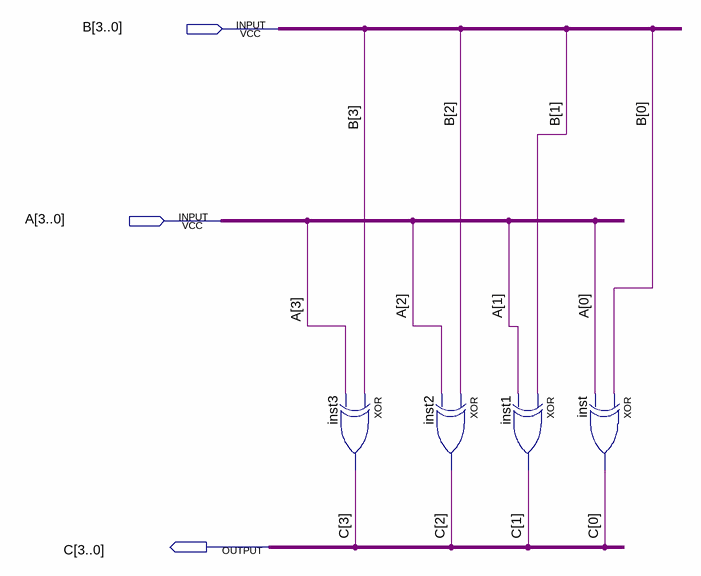
[diagram p0: schematic sheet]
// Quartus schematic portaXOR.bdf as structural Verilog: 4 symbols, 3 pins
module portaXOR (
  input  [3:0] B,
  input  [3:0] A,
  output [3:0] C
);

  xor inst3 (C[3], B[3], A[3]);
  xor inst2 (C[2], B[2], A[2]);
  xor inst1 (C[1], B[1], A[1]);
  xor inst (C[0], B[0], A[0]);
endmodule
